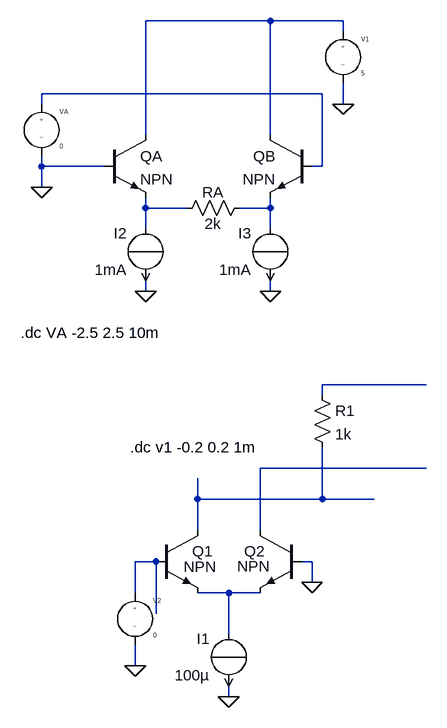
[diagram p0: schematic mult-2q.asc]
mult-2q.asc, the LTspice schematic file:
Version 4
SHEET 1 880 1028
WIRE 352 -32 160 -32
WIRE 464 -32 352 -32
WIRE 464 -16 464 -32
WIRE 432 80 0 80
WIRE 0 96 0 80
WIRE 464 96 464 64
WIRE 160 144 160 -32
WIRE 352 144 352 -32
WIRE 0 192 0 176
WIRE 96 192 0 192
WIRE 432 192 432 80
WIRE 432 192 416 192
WIRE 0 224 0 192
WIRE 160 256 160 240
WIRE 224 256 160 256
WIRE 352 256 352 240
WIRE 352 256 304 256
WIRE 160 288 160 256
WIRE 352 288 352 256
WIRE 160 384 160 368
WIRE 352 384 352 368
WIRE 592 528 432 528
WIRE 432 544 432 528
WIRE 592 656 336 656
WIRE 240 704 240 672
WIRE 432 704 432 624
WIRE 432 704 240 704
WIRE 512 704 432 704
WIRE 240 752 240 704
WIRE 336 752 336 656
WIRE 176 800 144 800
WIRE 416 800 400 800
WIRE 416 832 416 800
WIRE 144 848 144 800
WIRE 288 848 240 848
WIRE 336 848 288 848
WIRE 176 880 176 800
WIRE 288 912 288 848
WIRE 144 960 144 928
WIRE 288 1008 288 992
FLAG 0 224 0
FLAG 160 384 0
FLAG 352 384 0
FLAG 464 96 0
FLAG 288 1008 0
FLAG 144 960 0
FLAG 416 832 0
SYMBOL EIT_Semiconductors\\npn 96 144 R0
SYMATTR InstName QA
SYMBOL EIT_Semiconductors\\npn 416 144 M0
SYMATTR InstName QB
SYMBOL source-V 0 80 R0
SYMATTR InstName VA
SYMATTR Value 0
SYMBOL source-I 160 368 R180
WINDOW 0 29 73 Left 2
WINDOW 3 29 17 Left 2
SYMATTR InstName I2
SYMATTR Value 1mA
SYMBOL source-I 352 368 R180
WINDOW 0 29 73 Left 2
WINDOW 3 29 17 Left 2
SYMATTR InstName I3
SYMATTR Value 1mA
SYMBOL res 320 240 R90
WINDOW 0 7 56 VBottom 2
WINDOW 3 25 56 VTop 2
SYMATTR InstName RA
SYMATTR Value 2k
SYMBOL source-V 464 -32 R0
SYMATTR InstName V1
SYMATTR Value 5
SYMBOL EIT_Semiconductors\\npn 176 752 R0
WINDOW 3 43 56 Left 2
SYMATTR InstName Q1
SYMBOL EIT_Semiconductors\\npn 400 752 M0
WINDOW 3 49 55 Left 2
SYMATTR InstName Q2
SYMBOL source-I 288 992 R180
WINDOW 0 29 73 Left 2
WINDOW 3 29 17 Left 2
WINDOW 123 0 0 Left 2
WINDOW 39 0 0 Left 2
SYMATTR InstName I1
SYMATTR Value 100µ
SYMBOL source-V 144 832 R0
SYMATTR InstName V2
SYMATTR Value 0
SYMBOL res 416 528 R0
SYMATTR InstName R1
SYMATTR Value 1k
TEXT -32 448 Left 2 !.dc VA -2.5 2.5 10m
TEXT 136 624 Left 2 !.dc v1 -0.2 0.2 1m

The netlist it stands for:
* mult-2q.asc
QA N001 0 N003 0 NPN
QB N001 N002 N004 0 NPN
VA N002 0 0
I2 N003 0 1mA
I3 N004 0 1mA
RA N004 N003 2k
V1 N001 0 5
Q1 N007 N008 N009 0 NPN
Q2 N006 0 N009 0 NPN
I1 N009 0 100µ
V2 N008 0 0
R1 N005 N007 1k
.model NPN NPN
.model PNP PNP
.lib standard.bjt
.dc VA -2.5 2.5 10m
.dc v1 -0.2 0.2 1m
.backanno
.end